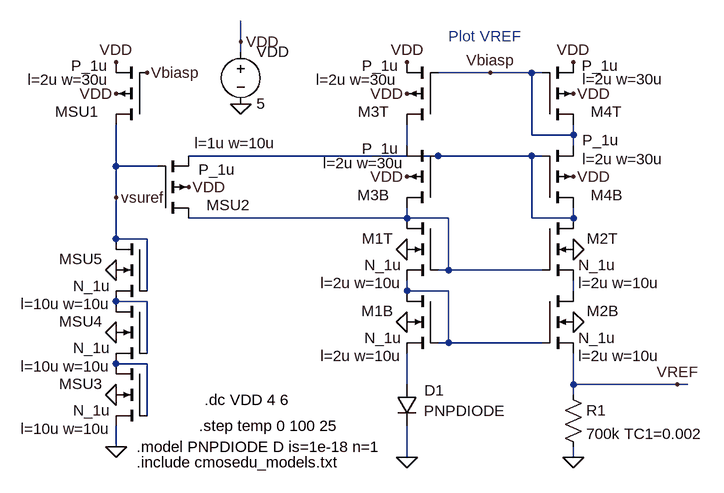
[diagram p0: schematic Fig23_23.asc]
Fig23_23.asc, the LTspice schematic file:
Version 4
SHEET 1 2352 680
WIRE 1616 -576 1616 -608
WIRE 1616 -560 1616 -576
WIRE 2000 -528 1920 -528
WIRE 2064 -528 2000 -528
WIRE 2080 -528 2064 -528
WIRE 2064 -432 2064 -528
WIRE 2128 -432 2128 -448
WIRE 2128 -432 2064 -432
WIRE 1872 -416 1872 -448
WIRE 2128 -416 2128 -432
WIRE 1920 -400 1536 -400
WIRE 2064 -400 1920 -400
WIRE 2080 -400 2064 -400
WIRE 1424 -384 1424 -448
WIRE 1488 -384 1424 -384
WIRE 1424 -336 1424 -384
WIRE 1872 -304 1872 -320
WIRE 1872 -304 1536 -304
WIRE 1936 -304 1872 -304
WIRE 2064 -304 2064 -400
WIRE 2128 -304 2128 -320
WIRE 2128 -304 2064 -304
WIRE 1424 -272 1424 -336
WIRE 1472 -272 1424 -272
WIRE 1936 -224 1936 -304
WIRE 1936 -224 1920 -224
WIRE 2080 -224 1936 -224
WIRE 1472 -192 1472 -272
WIRE 1872 -192 1872 -208
WIRE 1936 -192 1872 -192
WIRE 2128 -192 2128 -208
WIRE 1472 -176 1424 -176
WIRE 1936 -112 1936 -192
WIRE 1936 -112 1920 -112
WIRE 2080 -112 1936 -112
WIRE 1472 -96 1472 -176
WIRE 1472 -80 1424 -80
WIRE 1872 -48 1872 -96
WIRE 2128 -48 2128 -96
WIRE 2288 -48 2128 -48
WIRE 2304 -48 2288 -48
WIRE 2128 -32 2128 -48
WIRE 1472 0 1472 -80
WIRE 1424 48 1424 16
WIRE 1872 64 1872 16
WIRE 2128 64 2128 48
FLAG 1616 -480 0
FLAG 1616 -576 VDD
FLAG 1424 -32 0
FLAG 1424 48 0
FLAG 1424 -496 VDD
FLAG 1424 -544 VDD
FLAG 1872 -496 VDD
FLAG 1872 -544 VDD
FLAG 1872 -368 VDD
FLAG 2128 -496 VDD
FLAG 2128 -544 VDD
FLAG 2128 -368 VDD
FLAG 2128 -144 0
FLAG 2128 64 0
FLAG 1872 -144 0
FLAG 1872 64 0
FLAG 2128 -256 0
FLAG 1872 -256 0
FLAG 2288 -48 VREF
FLAG 1536 -352 VDD
FLAG 1424 -128 0
FLAG 1424 -224 0
FLAG 1424 -336 vsuref
FLAG 2000 -528 Vbiasp
FLAG 1472 -528 Vbiasp
SYMBOL voltage 1616 -576 R0
WINDOW 123 0 0 Left 2
WINDOW 39 0 0 Left 2
SYMATTR InstName VDD
SYMATTR Value 5
SYMBOL nmos4 1472 -80 M0
WINDOW 123 56 100 Left 2
WINDOW 0 69 31 Left 2
SYMATTR Value2 l=10u w=10u
SYMATTR InstName MSU3
SYMATTR Value N_1u
SYMBOL pmos4 1472 -448 R180
WINDOW 0 75 20 Left 2
WINDOW 3 61 91 Left 2
WINDOW 123 59 69 Left 2
SYMATTR InstName MSU1
SYMATTR Value P_1u
SYMATTR Value2 l=2u w=30u
SYMBOL pmos4 1920 -448 R180
WINDOW 0 75 20 Left 2
WINDOW 3 61 91 Left 2
WINDOW 123 63 69 Left 2
SYMATTR InstName M3T
SYMATTR Value P_1u
SYMATTR Value2 l=2u w=30u
SYMBOL pmos4 1920 -320 R180
WINDOW 0 75 20 Left 2
WINDOW 3 61 91 Left 2
WINDOW 123 52 69 Left 2
SYMATTR InstName M3B
SYMATTR Value P_1u
SYMATTR Value2 l=2u w=30u
SYMBOL pmos4 2080 -448 M180
WINDOW 0 75 20 Left 2
WINDOW 3 61 91 Left 2
WINDOW 123 62 70 Left 2
SYMATTR InstName M4T
SYMATTR Value P_1u
SYMATTR Value2 l=2u w=30u
SYMBOL pmos4 2080 -320 M180
WINDOW 0 75 20 Left 2
WINDOW 3 62 104 Left 2
WINDOW 123 62 75 Left 2
SYMATTR InstName M4B
SYMATTR Value P_1u
SYMATTR Value2 l=2u w=30u
SYMBOL nmos4 2080 -192 R0
WINDOW 123 56 100 Left 2
WINDOW 0 69 31 Left 2
SYMATTR Value2 l=2u w=10u
SYMATTR InstName M2B
SYMATTR Value N_1u
SYMBOL nmos4 1920 -192 M0
WINDOW 123 56 100 Left 2
WINDOW 0 69 31 Left 2
SYMATTR Value2 l=2u w=10u
SYMATTR InstName M1B
SYMATTR Value N_1u
SYMBOL res 2112 -48 R0
SYMATTR InstName R1
SYMATTR Value 700k TC1=0.002
SYMBOL nmos4 2080 -304 R0
WINDOW 123 56 100 Left 2
WINDOW 0 69 31 Left 2
SYMATTR Value2 l=2u w=10u
SYMATTR InstName M2T
SYMATTR Value N_1u
SYMBOL nmos4 1920 -304 M0
WINDOW 123 56 100 Left 2
WINDOW 0 69 31 Left 2
SYMATTR Value2 l=2u w=10u
SYMATTR InstName M1T
SYMATTR Value N_1u
SYMBOL diode 1856 -48 R0
WINDOW 0 43 9 Left 2
WINDOW 3 42 41 Left 2
SYMATTR InstName D1
SYMATTR Value PNPDIODE
SYMBOL pmos4 1488 -304 M180
WINDOW 0 75 20 Left 2
WINDOW 3 63 75 Left 2
WINDOW 123 57 116 Left 2
SYMATTR InstName MSU2
SYMATTR Value P_1u
SYMATTR Value2 l=1u w=10u
SYMBOL nmos4 1472 -176 M0
WINDOW 123 56 100 Left 2
WINDOW 0 69 31 Left 2
SYMATTR Value2 l=10u w=10u
SYMATTR InstName MSU4
SYMATTR Value N_1u
SYMBOL nmos4 1472 -272 M0
WINDOW 123 56 100 Left 2
WINDOW 0 69 31 Left 2
SYMATTR Value2 l=10u w=10u
SYMATTR InstName MSU5
SYMATTR Value N_1u
TEXT 1456 72 Left 2 !.include cmosedu_models.txt
TEXT 1936 -584 Left 2 ;Plot VREF
TEXT 1560 -24 Left 2 !.dc VDD 4 6
TEXT 1552 16 Left 2 !.step temp 0 100 25
TEXT 1456 48 Left 2 !.model PNPDIODE D is=1e-18 n=1

The netlist it stands for:
* Fig23_23.asc
VDD VDD 0 5
MSU3 N007 N007 0 0 N_1u l=10u w=10u
MSU1 vsuref Vbiasp VDD VDD P_1u l=2u w=30u
M3T N001 Vbiasp VDD VDD P_1u l=2u w=30u
M3B N003 N002 N001 VDD P_1u l=2u w=30u
M4T Vbiasp Vbiasp VDD VDD P_1u l=2u w=30u
M4B N002 N002 Vbiasp VDD P_1u l=2u w=30u
M2B N005 N004 VREF 0 N_1u l=2u w=10u
M1B N004 N004 N008 0 N_1u l=2u w=10u
R1 VREF 0 700k TC1=0.002
M2T N002 N003 N005 0 N_1u l=2u w=10u
M1T N003 N003 N004 0 N_1u l=2u w=10u
D1 N008 0 PNPDIODE
MSU2 N003 vsuref N002 VDD P_1u l=1u w=10u
MSU4 N006 N006 N007 0 N_1u l=10u w=10u
MSU5 vsuref vsuref N006 0 N_1u l=10u w=10u
.model D D
.lib standard.dio
.model NMOS NMOS
.model PMOS PMOS
.lib standard.mos
.include cmosedu_models.txt
* Plot VREF
.dc VDD 4 6
.step temp 0 100 25
.model PNPDIODE D is=1e-18 n=1
.backanno
.end